# Altium schematic sheet Keyboard.SchDoc
size A4
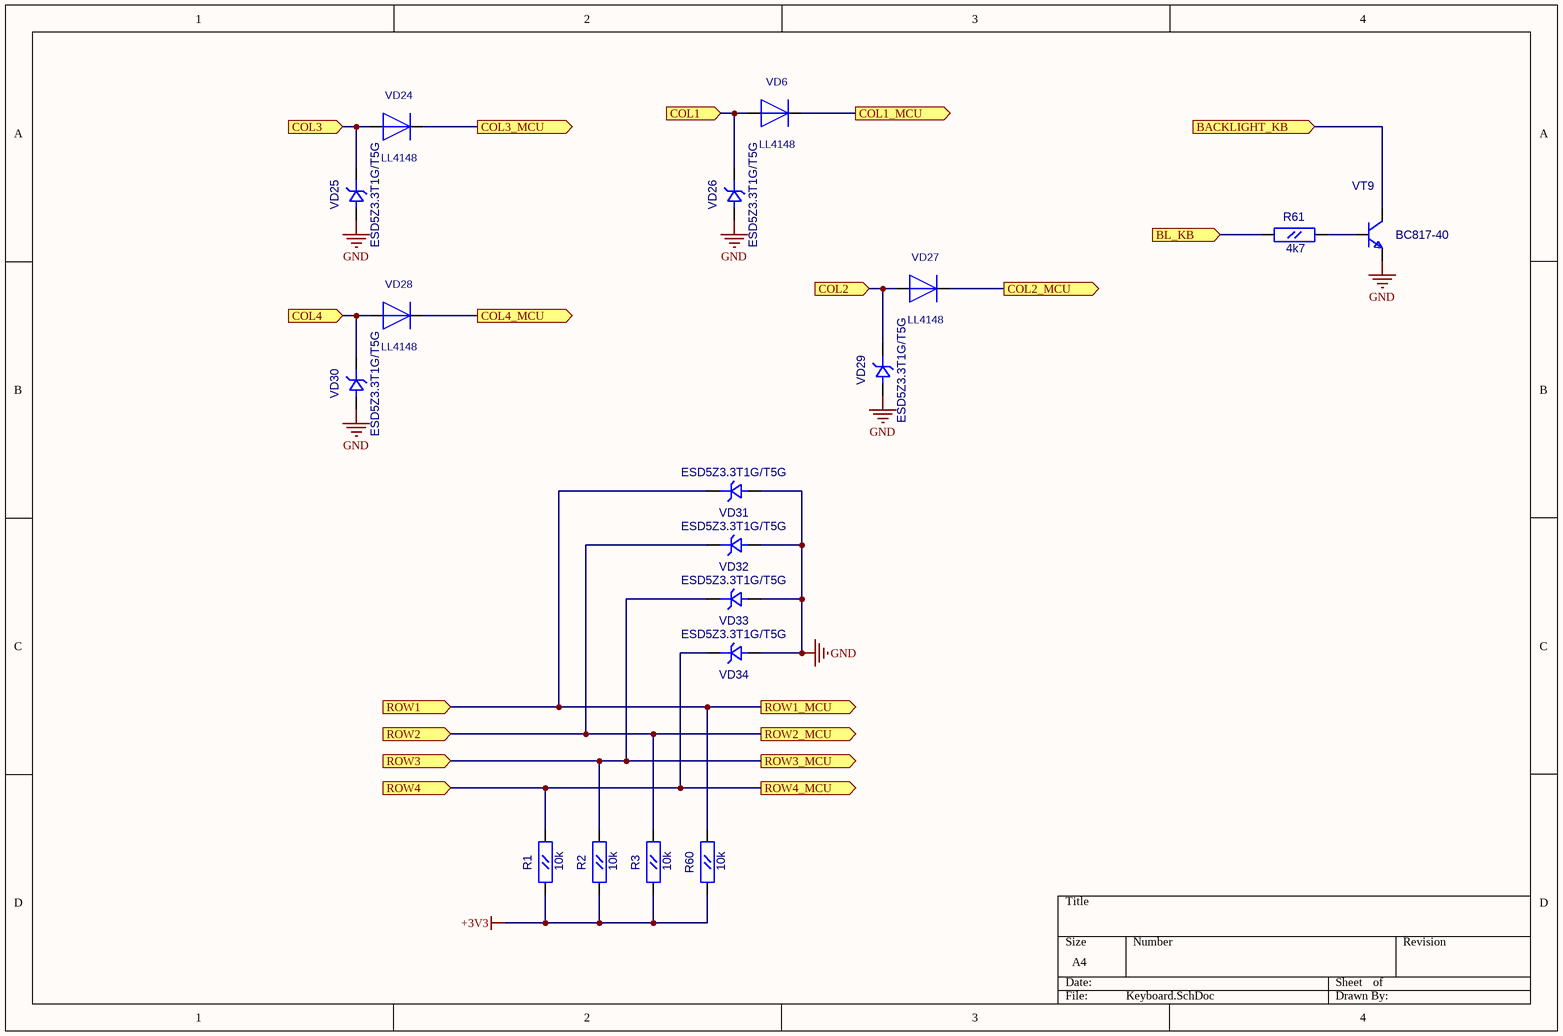
[diagram p0: Keyboard.SchDoc]

## Parts
R1  10k  [RC0603]
R2  10k  [RC0603]
R3  10k  [RC0603]
R60  10k  [RC0603]
R61  4k7  [RC0603]
VD6  LL4148  [SOD-80]
VD24  LL4148  [SOD-80]
VD25  ESD5Z3.3T1G/T5G  [SOD-523]
VD26  ESD5Z3.3T1G/T5G  [SOD-523]
VD27  LL4148  [SOD-80]
VD28  LL4148  [SOD-80]
VD29  ESD5Z3.3T1G/T5G  [SOD-523]
VD30  ESD5Z3.3T1G/T5G  [SOD-523]
VD31  ESD5Z3.3T1G/T5G  [SOD-523]
VD32  ESD5Z3.3T1G/T5G  [SOD-523]
VD33  ESD5Z3.3T1G/T5G  [SOD-523]
VD34  ESD5Z3.3T1G/T5G  [SOD-523]
VT9  BC817-40  [SOT-23(123)]

## Ports
BACKLIGHT_KB (in), BL_KB (in), COL1 (in), COL1_MCU (out), COL2 (in), COL2_MCU (out), COL3 (in), COL3_MCU (out), COL4 (in), COL4_MCU (out), ROW1 (in), ROW1_MCU (out), ROW2 (in), ROW2_MCU (out), ROW3 (in), ROW3_MCU (out), ROW4 (in), ROW4_MCU (out)

## Nets
+3V3: R1.1(A) R2.1(A) R3.1(A) R60.1(A)
GND: VD25.1(A) VD26.1(A) VD29.1(A) VD30.1(A) VD31.1(A) VD32.1(A) VD33.1(A) VD34.1(A) VT9.2(E)
BACKLIGHT_KB: VT9.3(C) ; port BACKLIGHT_KB
BL_KB: R61.1(A) ; port BL_KB
COL1: VD6.1(-) VD26.2(K) ; port COL1
COL1_MCU: VD6.2(+) ; port COL1_MCU
COL2: VD27.1(-) VD29.2(K) ; port COL2
COL2_MCU: VD27.2(+) ; port COL2_MCU
COL3: VD24.1(-) VD25.2(K) ; port COL3
COL3_MCU: VD24.2(+) ; port COL3_MCU
COL4: VD28.1(-) VD30.2(K) ; port COL4
COL4_MCU: VD28.2(+) ; port COL4_MCU
ROW1: R60.2(B) VD31.2(K) ; port ROW1_MCU, port ROW1
ROW2: R3.2(B) VD32.2(K) ; port ROW2_MCU, port ROW2
ROW3: R2.2(B) VD33.2(K) ; port ROW3_MCU, port ROW3
ROW4: R1.2(B) VD34.2(K) ; port ROW4_MCU, port ROW4
NetR61_2: R61.2(B) VT9.1(B)

## Library data of the parts
R1-R3 R60 R61 = RC0603
  R1-R3 R60: Value: 10k
  R61: Value: 4k7
VD25 VD26 VD29-VD34 = ESD5Z: Supressor; Value: ESD5Z3.3T1G/T5G
VT9 = BC846BLT1: NPN 500ma transistor; ComponentField7: Published 29-Sep-2000; OriginalName: BC846BLT1; Value: BC817-40
VD6 VD24 VD27 VD28 = LL4148: Value: *